# EAGLE design vineseenon (EAGLE 9.6.2)

## Sheet 1 of 2
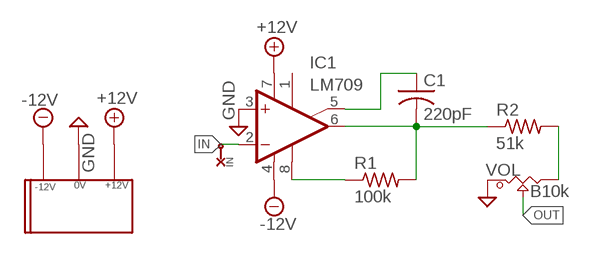
[diagram p0: schematic, sheet 1]

### Parts
C1  220pF  C-USC0603  [C0603]
IC1  LM709  TL061P  [DIL08]
IN  PAD  [1PAD_B]
R1  100k  R-US_R0603  [R0603]
R2  51k  R-US_R0603  [R0603]
U$1  EURO_POW_CEH  [EURO_POW_CEH]
VOL  B10k  POT_9MM_SMD  [POT_9MM_SMD]

### Nets
+12V: IC1.7(V+) U$1.+12V
-12V: IC1.4(V-) U$1.-12V
GND: IC1.3(+IN) U$1.GND VOL.1
IN: IC1.2(-IN) IN.1
N$1: IC1.8(OPT) R1.1
N$2: C1.2 IC1.6(OUT) R1.2 R2.1
N$3: C1.1 IC1.5(ON2)
N$4: R2.2 VOL.3
OUT: VOL.2
Unconnected: IC1.1(ON1)

## Sheet 2 of 2

## Library data of the parts
C1 = adafruit:C-US: CAPACITOR, American symbol
IC1 = linear:TL061: OP AMP
IN = Mech_BO_CE_SW:PAD
R1 R2 = adafruit:R-US_: RESISTOR, American symbol
U$1 = 2.54mm_PowHeader_SMD:EURO_POW_CEH: Eurorack Power Header Reduced Card Edge Surface Mount Pads
VOL = Mech_BO_CE_SW:POT_9MM_SMD

## Board
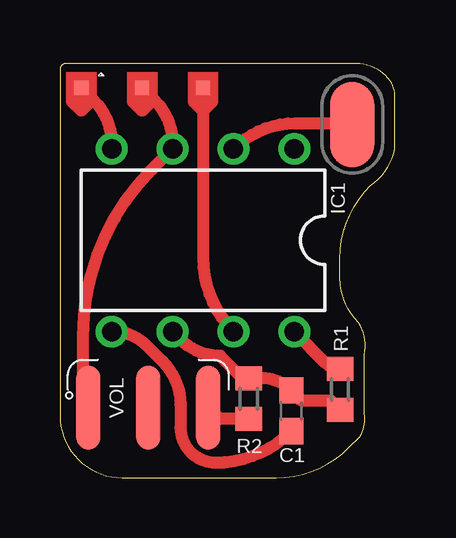
[diagram p1: board, top side]

Size 13.97 x 17.27 mm. Coordinates in mm from the lower left corner, seen from the top.
Outline: 9.02,0 arc45 12.05,1.26 12.51,1.71 arc45 12.7,2.67 12.7,5.12 arc45 12.45,6.48 arc-45 11.68,8.32 11.68,9.14 arc-45 12.94,12.18 12.95,12.19 arc45 13.97,13.72 13.97,15.97 arc45 13.59,16.76 arc45 12.36,17.27 0.25,17.27 arc90 0,17.02 0,2.6 arc45 0.76,0.76 arc45 2.6,0 9.02,0
Copper layers (1*16): Top 0.035mm / dielectric 1.5mm / Bottom 0.035mm
Design rules "default *": minimum track width 6mil, minimum drill 0.35mm, track to track 6mil, track to pad 6mil, pad to pad 6mil, via to via 6mil, smd to smd 6mil, copper to edge 10mil, drill to drill 6mil, minimum pad ring 10mil, minimum via ring 8mil, stop-mask expansion 4mil, vias tented up to drill 0mil, thermal gap 10mil

### Footprints (pad centres in the part's own frame; a part is rotated, then mirrored left to right if it is on the bottom)
C0603 = smd 1.1 x 1: 1 -0.85,0; 2 0.85,0
DIL08 = drill 0.813 pad 1.27: 1 -3.81,-3.81; 2 -1.27,-3.81; 3 1.27,-3.81; 4 3.81,-3.81; 5 3.81,3.81; 6 1.27,3.81; 7 -1.27,3.81; 8 -3.81,3.81
1PAD_B = smd 1.829 x 3.556: 1 0,0
R0603 = smd 1 x 1.1: 1 -0.85,0; 2 0.85,0
EURO_POW_CEH = smd 0.6 x 0.6: +12V 0,-3.175; -12V 5.08,-3.175; GND 2.54,-3.175
POT_9MM_SMD = smd 0.991 x 3.505: 1 -2.5,0; 2 0,0; 3 2.5,0

### Placement (x,y rotation side)
C1  9.65,2.79 90 top
IC1  5.97,9.91 180 top
IN  12.19,14.73 180 top
R1  11.68,3.68 270 top
R2  7.87,3.3 270 top
U$1  5.97,13.08 180 top
VOL  3.68,2.92 0 top

### Tracks (layer width: path | path; a pad name or v marks a point on that pad's centre or on a via)
+12V
  Top 0.508: U$1.+12V 5.97,9.16 arc45 IC1.7
-12V
  Top 0.508: U$1.-12V 1.42,15.73 arc-45 2.16,13.93 IC1.4
GND
  Top 0.508: U$1.GND 3.96,15.73 arc-45 4.7,13.93 IC1.3 3.85,12.87 arc45 0.96,5.9 0.96,3.14 VOL.1
IN
  Top 0.508: IC1.2 arc-45 9.81,14.78 12.14,14.78 IN.1
N$1
  Top 0.508: R1.1 arc-45 11.1,4.78 IC1.8
N$2
  Top 0.508: R1.2 11.3,3.21 10.08,3.21 C1.2 arc45 8.43,4.15 R2.1 7.61,4.15 6.68,5.08 arc-45 5.03,5.76 IC1.6
N$3
  Top 0.508: IC1.5 arc-45 3.66,5.47 4.28,4.85 arc-45 5.03,3.06 5.03,2.1 arc90 6.49,0.64 arc45 C1.1
N$4
  Top 0.508: R2.2 6.65,2.45 VOL.3